# Altium schematic sheet Sheet1.SchDoc
size B
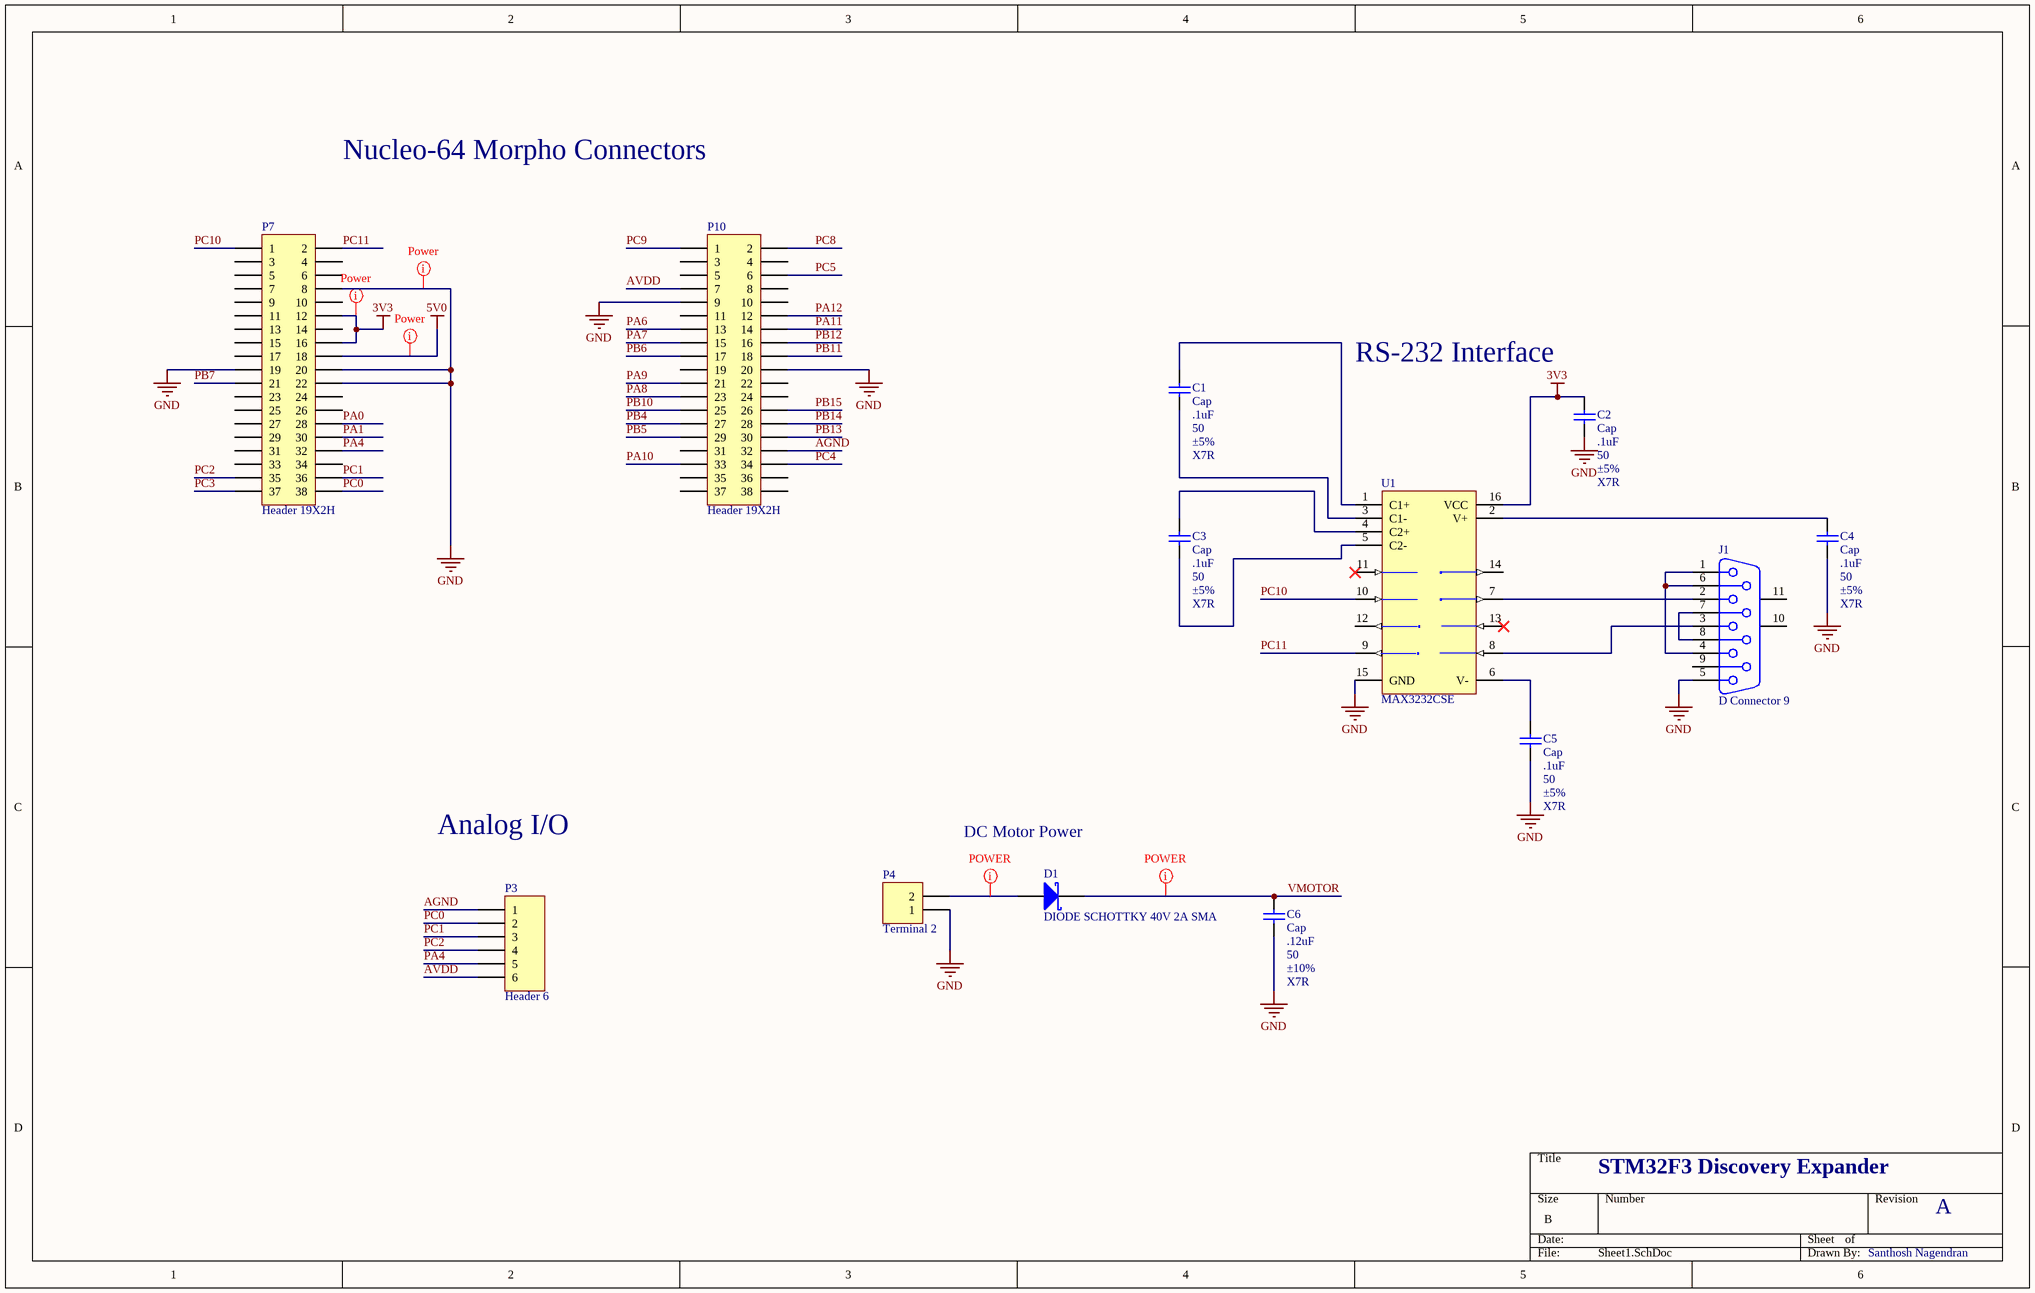
[diagram p0: Sheet1.SchDoc]

## Parts
C1  Cap  value .1uF  WV: 50  Tolerance: ±5%  Type: X7R  [CAPC2012X09M]
C2  Cap  value .1uF  WV: 50  Tolerance: ±5%  Type: X7R  [CAPC2012X09M]
C3  Cap  value .1uF  WV: 50  Tolerance: ±5%  Type: X7R  [CAPC2012X09M]
C4  Cap  value .1uF  WV: 50  Tolerance: ±5%  Type: X7R  [CAPC2012X09M]
C5  Cap  value .1uF  WV: 50  Tolerance: ±5%  Type: X7R  [CAPC2012X09M]
C6  Cap  value .12uF  WV: 50  Tolerance: ±10%  Type: X7R  [CAPC2012X09M]
D1  DIODE SCHOTTKY 40V 2A SMA  [DIOM4326X23M]
J1  D Connector 9  [DSUB1.385-2H9]
P3  Header 6  [HDR1X6]
P4  Terminal 2  [TYCO_282841_2]
P7  Header 19X2H  [PPPC192LFBN-RC]
P10  Header 19X2H  [PPPC192LFBN-RC]
U1  MAX3232CSE  [NSO16_N]

## Nets
3V3: C2.2 P7.12 P7.16 U1.16(VCC)
5V0: P7.18
GND: C2.1 C4.1 C5.1 C6.1 J1.5 P4.1 P7.8 P7.19 P7.20 P7.22 P10.9 P10.20 U1.15(GND)
AGND: P3.1 P10.32
AVDD: P3.6 P10.7
PA0: P7.28
PA1: P7.30
PA4: P3.5 P7.32
PA6: P10.13
PA7: P10.15
PA8: P10.23
PA9: P10.21
PA10: P10.33
PA11: P10.14
PA12: P10.12
PB4: P10.27
PB5: P10.29
PB6: P10.17
PB7: P7.21
PB10: P10.25
PB11: P10.18
PB12: P10.16
PB13: P10.30
PB14: P10.28
PB15: P10.26
PC0: P3.2 P7.38
PC1: P3.3 P7.36
PC2: P3.4 P7.35
PC3: P7.37
PC4: P10.34
PC5: P10.6
PC8: P10.2
PC9: P10.1
PC10: P7.1 U1.10(T2IN)
PC11: P7.2 U1.9(R2OUT)
VMOTOR: C6.2 D1.1(K)
NetC1_1: C1.1 U1.3(C1-)
NetC1_2: C1.2 U1.1(C1+)
NetC3_1: C3.1 U1.5(C2-)
NetC3_2: C3.2 U1.4(C2+)
NetC4_2: C4.2 U1.2(V+)
NetC5_2: C5.2 U1.6(V-)
NetD1_2: D1.2(A) P4.2
NetJ1_1: J1.1 J1.4 J1.6
NetJ1_2: J1.2 U1.7(T2OUT)
NetJ1_3: J1.3 U1.8(R2IN)
NetJ1_7: J1.7 J1.8

Not connected (* = marked no-connect by the designer): J1 9 10(MH1) 11(MH2); P7 3 4 5 6 7 9 10 11 13 14 15 17 23 24 25 26 27 29 31 33 34; P10 3 4 5 8 10 11 19 22 24 31 35 36 37 38; U1 11(T1IN)* 12(R1OUT) 13(R1IN)* 14(T1OUT)

## Layout directives
net class Power: 3V3, 5V0, GND
mark named POWER: NetD1_2, VMOTOR

## Notes on the sheet
- Nucleo-64 Morpho Connectors
- (near C2) RS-232 Interface
- Analog I/O
- DC Motor Power
- STM32F3 Discovery Expander
- A
- Santhosh Nagendran

## Library data of the parts
C1-C5 = CAP-X7R-.1uF-50V-±5%: CAP CER .1uF 50v X7R 0805; MPN: C0805C104J5RACTU; PN: 399-1171-1-ND; Name: CAP-X7R-.1uF-50V-±5%; URL: http://www.digikey.ca/product-detail/en/C0805C104J5RACTU/399-1171-1-ND
C6 = CAP-X7R-.12uF-50V-±10%: CAP CER .12uF 50v X7R 0805; MPN: C0805C124K5RACTU; PN: 399-3487-1-ND; Name: CAP-X7R-.12uF-50V-±10%; URL: http://www.digikey.ca/product-detail/en/C0805C124K5RACTU/399-3487-1-ND
D1 = DIODE SCHOTTKY 40V 2A SMA: Schottky Rectifier; MPN: B240A-13-F; PN: B240A-FDICT-ND; URL: http://www.digikey.ca/product-detail/en/B240A-13-F/B240A-FDICT-ND
J1 = D Connector 9: Receptacle Assembly, 9 Position, Right Angle; MPN: ADF09A-KG-TASB3-R; PN: AE10921-ND; URL: http://www.digikey.ca/product-detail/en/ADF09A-KG-TASB3-R/AE10921-ND
P3 = Header 6: Header, 6-Pin Male; MPN: PEC06SFAN; PN: S1212E-06-ND; URL: http://www.digikey.ca/product-detail/en/PEC06SFAN/S1212E-06-ND
P4 = Terminal 2: Terminal, 2-Pin; MPN: 282841-2; PN: A98342-ND; LatestRevisionDate: 17-Jul-2002; LatestRevisionNote: Re-released for DXP Platform.; Publisher: Altium Limited; URL: http://www.digikey.ca/product-detail/en/282841-2/A98342-ND/1136740
P7 P10 = Header 19X2H: 38 Position Header Connector 0.100in (2.54mm) Through Hole Gold; PN: S7122-ND; URL: https://www.digikey.ca/product-detail/en/sullins-connector-solutions/PPPC192LFBN-RC/S7122-ND; MPN: PPPC192LFBN-RC
U1 = MAX3232CSE: 3.0V TO 5.5V, Low-Power, up to 1Mbps, True RS-232 Transceiver Using Four 0.1µF External Capacitor; MPN: MAX3232CSE+; PN: MAX3232CSE+-ND; Published: 16-Jan-2001; LatestRevisionDate: 13-Apr-2006; LatestRevisionNote: IPC-7351 Footprint Added.; DatasheetVersion: Mar-1999; PackageReference: NSO16; Publisher: Altium Limited; PackageDescription: 16-Pin Small Outline Integrated Circuit 1.27 mm Pitch; Code_JEDEC: MS-012-AC; Code_IPC: SOIC127P600-16; ComponentLink1Description: Manufacturer Link; ComponentLink1URL: http://www.maxim-ic.com/; ComponentLink2Description: Datasheet; ComponentLink2URL: http://pdfserv.maxim-ic.com/en/ds/MAX3222-MAX3241.pdf; URL: http://www.digikey.ca/product-detail/en/MAX3232CSE%2B/MAX3232CSE%2B-ND